# EAGLE design Button_Pad_Breakout-v05 (EAGLE 5.01)
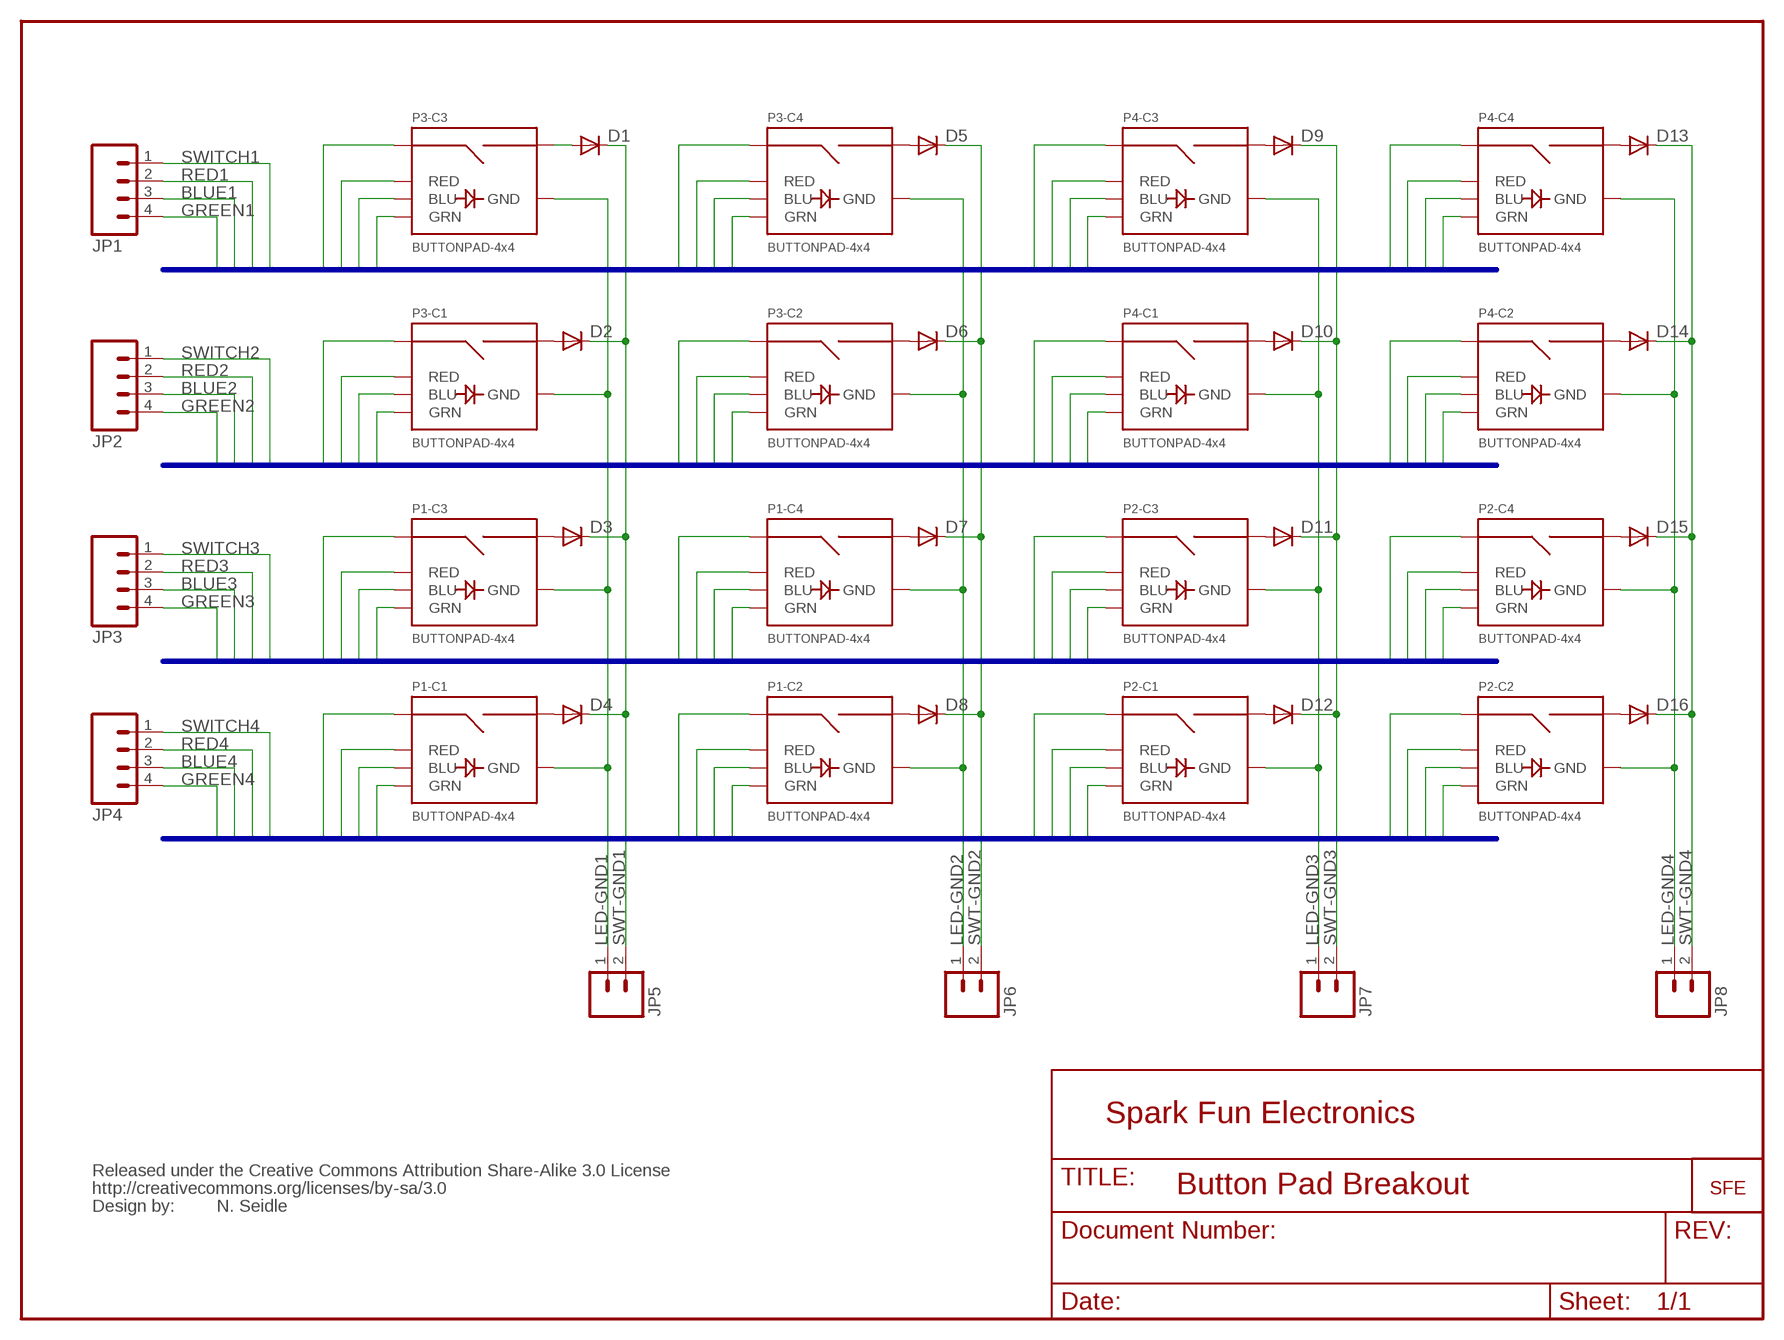
[diagram p0: schematic, sheet 1]

## Parts
D1  DIODE-1N4148  [DOIDE-1N4148]
D2  DIODE-1N4148  [DOIDE-1N4148]
D3  DIODE-1N4148  [DOIDE-1N4148]
D4  DIODE-1N4148  [DOIDE-1N4148]
D5  DIODE-1N4148  [DOIDE-1N4148]
D6  DIODE-1N4148  [DOIDE-1N4148]
D7  DIODE-1N4148  [DOIDE-1N4148]
D8  DIODE-1N4148  [DOIDE-1N4148]
D9  DIODE-1N4148  [DOIDE-1N4148]
D10  DIODE-1N4148  [DOIDE-1N4148]
D11  DIODE-1N4148  [DOIDE-1N4148]
D12  DIODE-1N4148  [DOIDE-1N4148]
D13  DIODE-1N4148  [DOIDE-1N4148]
D14  DIODE-1N4148  [DOIDE-1N4148]
D15  DIODE-1N4148  [DOIDE-1N4148]
D16  DIODE-1N4148  [DOIDE-1N4148]
JP1  M04POLAR  [MOLEX-1X4]
JP2  M04POLAR  [MOLEX-1X4]
JP3  M04POLAR  [MOLEX-1X4]
JP4  M04POLAR  [MOLEX-1X4]
JP5  M02POLAR  [MOLEX-1X2]
JP6  M02POLAR  [MOLEX-1X2]
JP7  M02POLAR  [MOLEX-1X2]
JP8  M02POLAR  [MOLEX-1X2]
P1  BUTTONPAD-4x4  BUTTONPAD-2X2  [BUTTONPAD-2X2]
P2  BUTTONPAD-4x4  BUTTONPAD-2X2  [BUTTONPAD-2X2]
P3  BUTTONPAD-4x4  BUTTONPAD-2X2  [BUTTONPAD-2X2]
P4  BUTTONPAD-4x4  BUTTONPAD-2X2  [BUTTONPAD-2X2]
U$1  LOGO-SFE  [SFE-NEW-WEBLOGO]
U$2  CREATIVE_COMMONS  [CREATIVE_COMMONS]

## Nets
BLUE1 [LEDPower]: JP1.3 P3.BLU3(-C3:BLU) P3.BLU4(-C4:BLU) P4.BLU3(-C3:BLU) P4.BLU4(-C4:BLU)
BLUE2 [LEDPower]: JP2.3 P3.BLU1(-C1:BLU) P3.BLU2(-C2:BLU) P4.BLU1(-C1:BLU) P4.BLU2(-C2:BLU)
BLUE3 [LEDPower]: JP3.3 P1.BLU3(-C3:BLU) P1.BLU4(-C4:BLU) P2.BLU3(-C3:BLU) P2.BLU4(-C4:BLU)
BLUE4 [LEDPower]: JP4.3 P1.BLU1(-C1:BLU) P1.BLU2(-C2:BLU) P2.BLU1(-C1:BLU) P2.BLU2(-C2:BLU)
GREEN1 [LEDPower]: JP1.4 P3.GRN3(-C3:GRN) P3.GRN4(-C4:GRN) P4.GRN3(-C3:GRN) P4.GRN4(-C4:GRN)
GREEN2 [LEDPower]: JP2.4 P3.GRN1(-C1:GRN) P3.GRN2(-C2:GRN) P4.GRN1(-C1:GRN) P4.GRN2(-C2:GRN)
GREEN3 [LEDPower]: JP3.4 P1.GRN3(-C3:GRN) P1.GRN4(-C4:GRN) P2.GRN3(-C3:GRN) P2.GRN4(-C4:GRN)
GREEN4 [LEDPower]: JP4.4 P1.GRN1(-C1:GRN) P1.GRN2(-C2:GRN) P2.GRN1(-C1:GRN) P2.GRN2(-C2:GRN)
LED-GND1 [LEDPower]: JP5.1 P1.GND1(-C1:GND) P1.GND3(-C3:GND) P3.GND1(-C1:GND) P3.GND3(-C3:GND)
LED-GND2 [LEDPower]: JP6.1 P1.GND2(-C2:GND) P1.GND4(-C4:GND) P3.GND2(-C2:GND) P3.GND4(-C4:GND)
LED-GND3 [LEDPower]: JP7.1 P2.GND1(-C1:GND) P2.GND3(-C3:GND) P4.GND1(-C1:GND) P4.GND3(-C3:GND)
LED-GND4 [LEDPower]: JP8.1 P2.GND2(-C2:GND) P2.GND4(-C4:GND) P4.GND2(-C2:GND) P4.GND4(-C4:GND)
N$1: D1.P$1(A) P3.SIG6(-C3:SIG2)
N$2: D2.P$1(A) P3.SIG2(-C1:SIG2)
N$3: D3.P$1(A) P1.SIG6(-C3:SIG2)
N$4: D4.P$1(A) P1.SIG2(-C1:SIG2)
N$5: D5.P$1(A) P3.SIG8(-C4:SIG2)
N$6: D6.P$1(A) P3.SIG4(-C2:SIG2)
N$7: D7.P$1(A) P1.SIG8(-C4:SIG2)
N$8: D8.P$1(A) P1.SIG4(-C2:SIG2)
N$9: D9.P$1(A) P4.SIG6(-C3:SIG2)
N$10: D10.P$1(A) P4.SIG2(-C1:SIG2)
N$11: D11.P$1(A) P2.SIG6(-C3:SIG2)
N$12: D12.P$1(A) P2.SIG2(-C1:SIG2)
N$13: D13.P$1(A) P4.SIG8(-C4:SIG2)
N$14: D14.P$1(A) P4.SIG4(-C2:SIG2)
N$15: D15.P$1(A) P2.SIG8(-C4:SIG2)
N$16: D16.P$1(A) P2.SIG4(-C2:SIG2)
RED1 [LEDPower]: JP1.2 P3.RED3(-C3:RED) P3.RED4(-C4:RED) P4.RED3(-C3:RED) P4.RED4(-C4:RED)
RED2 [LEDPower]: JP2.2 P3.RED1(-C1:RED) P3.RED2(-C2:RED) P4.RED1(-C1:RED) P4.RED2(-C2:RED)
RED3 [LEDPower]: JP3.2 P1.RED3(-C3:RED) P1.RED4(-C4:RED) P2.RED3(-C3:RED) P2.RED4(-C4:RED)
RED4 [LEDPower]: JP4.2 P1.RED1(-C1:RED) P1.RED2(-C2:RED) P2.RED1(-C1:RED) P2.RED2(-C2:RED)
SWITCH1 [ButtonSignal]: JP1.1 P3.SIG5(-C3:SIG1) P3.SIG7(-C4:SIG1) P4.SIG5(-C3:SIG1) P4.SIG7(-C4:SIG1)
SWITCH2 [ButtonSignal]: JP2.1 P3.SIG1(-C1:SIG1) P3.SIG3(-C2:SIG1) P4.SIG1(-C1:SIG1) P4.SIG3(-C2:SIG1)
SWITCH3 [ButtonSignal]: JP3.1 P1.SIG5(-C3:SIG1) P1.SIG7(-C4:SIG1) P2.SIG5(-C3:SIG1) P2.SIG7(-C4:SIG1)
SWITCH4 [ButtonSignal]: JP4.1 P1.SIG1(-C1:SIG1) P1.SIG3(-C2:SIG1) P2.SIG1(-C1:SIG1) P2.SIG3(-C2:SIG1)
SWT-GND1 [ButtonSignal]: D1.P$2(C) D2.P$2(C) D3.P$2(C) D4.P$2(C) JP5.2
SWT-GND2 [ButtonSignal]: D5.P$2(C) D6.P$2(C) D7.P$2(C) D8.P$2(C) JP6.2
SWT-GND3 [ButtonSignal]: D9.P$2(C) D10.P$2(C) D11.P$2(C) D12.P$2(C) JP7.2
SWT-GND4 [ButtonSignal]: D13.P$2(C) D14.P$2(C) D15.P$2(C) D16.P$2(C) JP8.2

## Buses
BUS3:RED3,BLUE3,GREEN3,SWITCH3
BUS2:RED2,BLUE2,GREEN2,SWITCH2
BUS1:RED1,BLUE1,GREEN1,SWITCH1
BUS4:RED4,BLUE4,GREEN4,SWITCH4

## Notes on the sheet
- Spark Fun Electronics
- Button Pad Breakout
- N. Seidle

## Library data of the parts
D1-D16 = SparkFun:DIODE-1N4148
JP1-JP4 = SparkFun:M04: Header 4 Standard 4-pin 0.1" header. Use with straight break away headers (SKU : PRT-00116), right angle break away headers (PRT-00553), swiss pins (PRT-00743), machine pins (PRT-00117), and female headers (PRT-00115). Molex polarized connector foot print use with SKU : PRT-08231 with associated crimp pins and housings.
JP5-JP8 = SparkFun:M02: Header 2 Standard 2-pin 0.1" header. Use with straight break away headers (SKU : PRT-00116), right angle break away headers (PRT-00553), swiss pins (PRT-00743), machine pins (PRT-00117), and female headers (PRT-00115). Molex polarized connector foot print use with SKU : PRT-08233 with associated crimp pins and housings.
P1-P4 = SparkFun:BUTTONPAD-2X2: 5mm Button Pad Proven layout and schematic for 2x2 button pad. Panelize this device/fp to a 4x4 pad if needed. Spark Fun Electronics SKU : COM-07835. Compatible common cathode tri-color LED SKU : COM-00105
U$1 = SparkFun:LOGO-SFE: Spark Fun Electronics PCB Logo This is the standard Spark Fun Electronics PCB logo.
U$2 = SparkFun:CREATIVE_COMMONS

## Net classes
0 Default: width 0.254 mm
1 Power: width 0.305 mm
2 LEDPower: width 0.305 mm
3 ButtonSignal: width 0.254 mm

## Board
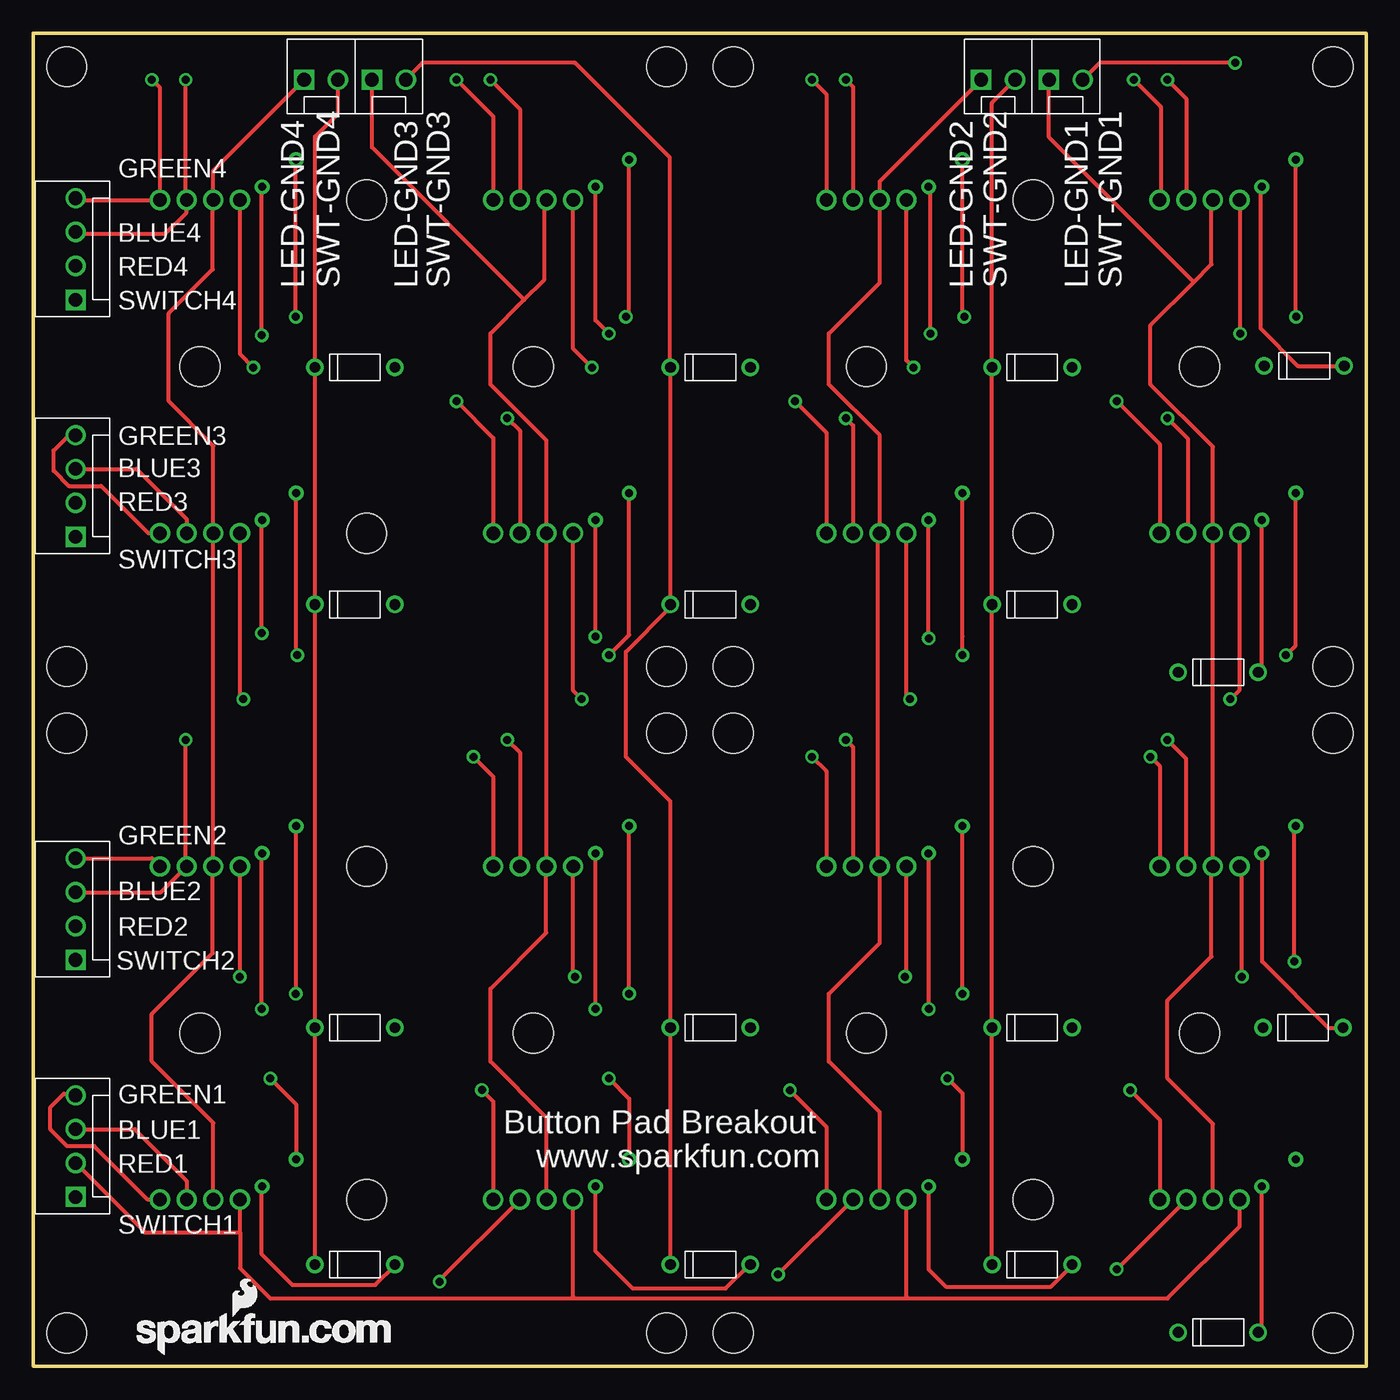
[diagram p1: board, top side]
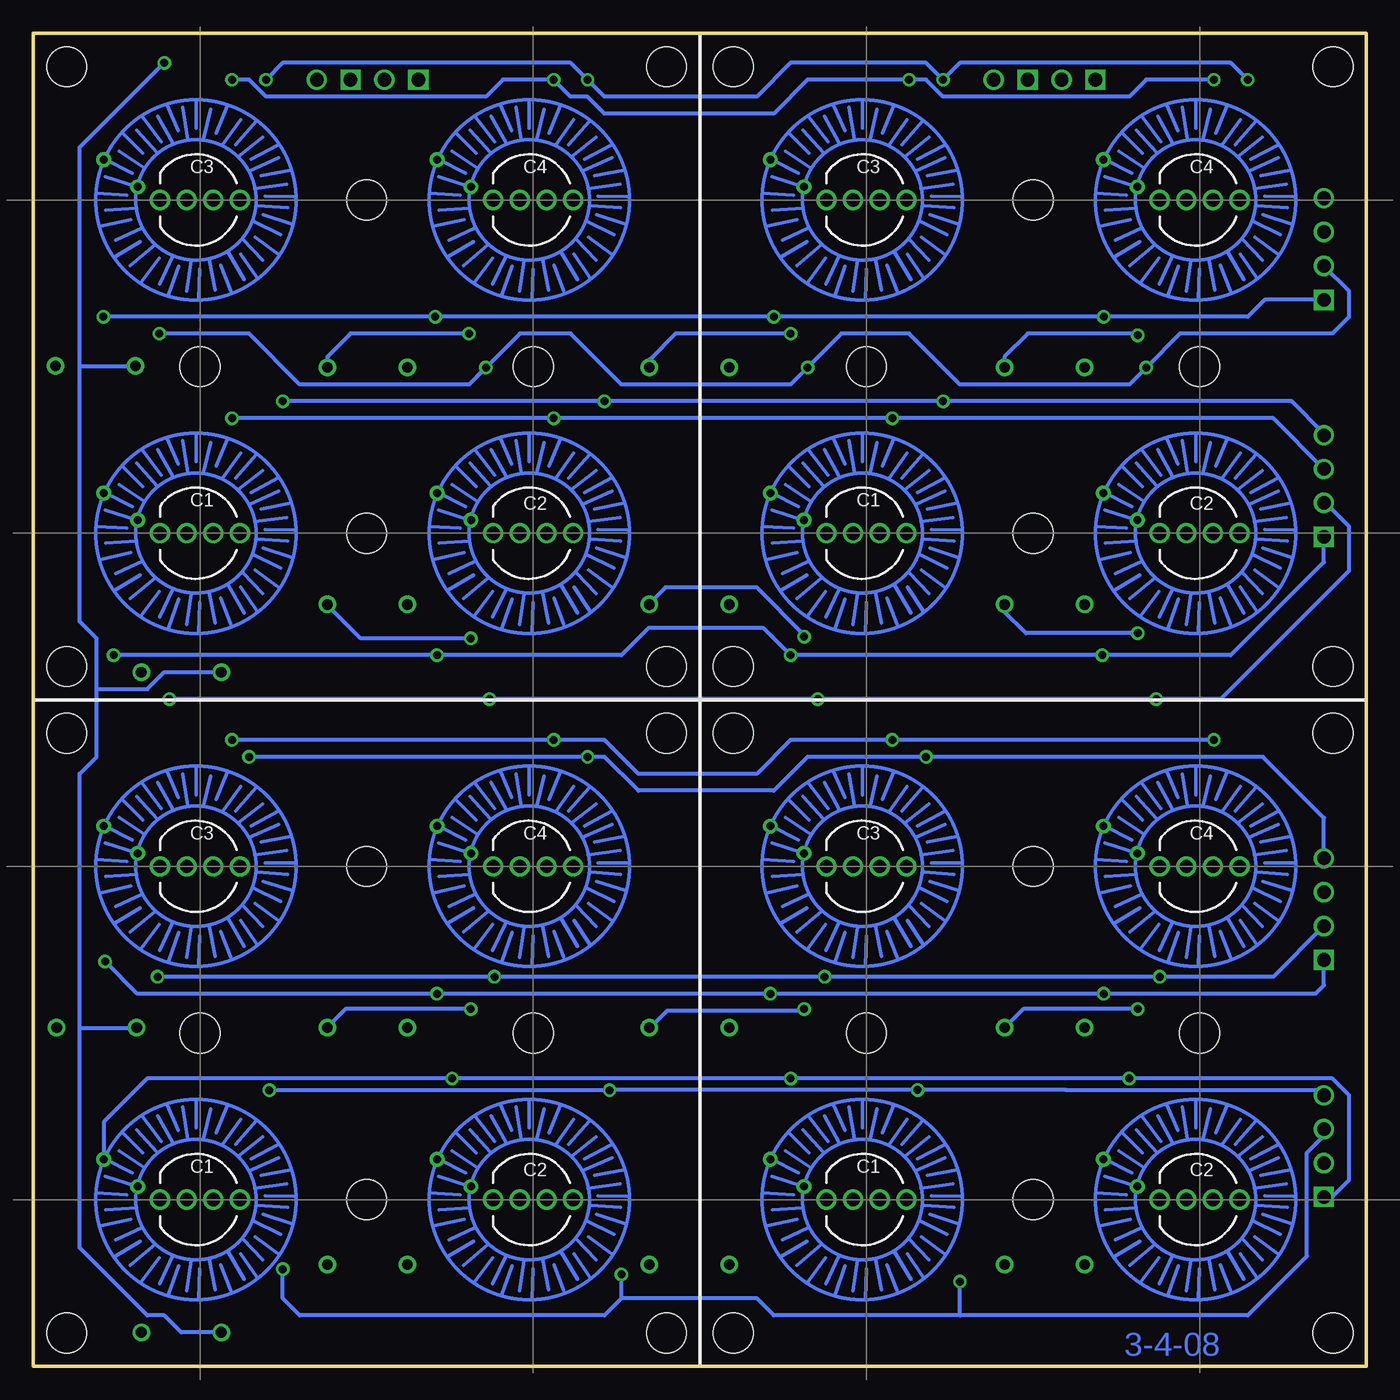
[diagram p2: board, bottom side, seen from below]

Size 100 x 100 mm. Coordinates in mm from the lower left corner, seen from the top.
Outline: 0,0 100,0 100,100 0,100 0,0
Copper layers (1*16): Top 0.035mm / dielectric 1.5mm / Bottom 0.035mm
Design rules "default": minimum track width 7mil, minimum drill 20mil, track to track 7mil, track to pad 7mil, pad to pad 7mil, via to via 7mil, smd to smd 7mil, copper to edge 20mil, drill to drill 7mil, minimum pad ring 10mil, minimum via ring 8mil, stop-mask expansion 4mil, vias tented up to drill 0mil, thermal gap 10mil

### Footprints (pad centres in the part's own frame; a part is rotated, then mirrored left to right if it is on the bottom)
DOIDE-1N4148 = drill 0.8 round: P$1 3,0; P$2 -3,0
MOLEX-1X4 = drill 1.016 square: 1 0,0 | drill 1.016 round: 2 2.54,0; 3 5.08,0; 4 7.62,0
MOLEX-1X2 = drill 1.016 square: 1 0,0 | drill 1.016 round: 2 2.54,0
BUTTONPAD-2X2 = drill 1 round: BLU1 13.5,12.5; BLU2 38.5,12.5; BLU3 13.5,37.5; BLU4 38.5,37.5; GND1 11.5,12.5; GND2 36.5,12.5; GND3 11.5,37.5; GND4 36.5,37.5; GRN1 15.5,12.5; GRN2 40.5,12.5; GRN3 15.5,37.5; GRN4 40.5,37.5; RED1 9.5,12.5; RED2 34.5,12.5; RED3 9.5,37.5; RED4 34.5,37.5 | drill 0.6 round: SIG1 5.288,15.513; SIG2 7.828,13.481; SIG3 30.288,15.513; SIG4 32.828,13.481; SIG5 5.288,40.513; SIG6 7.828,38.481; SIG7 30.288,40.513; SIG8 32.828,38.481 | hole 3: 12.5,25; 25,37.5; 37.5,25; 25,12.5; 2.5,2.5; 2.5,47.5; 47.5,47.5; 47.5,2.5

### Placement (x,y rotation side)
D1  50.8,74.93 0 top
D2  50.8,57.15 0 top
D3  50.8,25.4 0 top
D4  50.8,7.62 0 top
D5  24.13,74.93 0 top
D6  24.13,57.15 0 top
D7  24.13,25.4 0 top
D8  24.13,7.62 0 top
D9  95.35,75.05 0 top
D10  88.9,52.07 0 top
D11  95.25,25.4 0 top
D12  88.9,2.54 0 top
D13  74.93,74.93 0 top
D14  74.93,57.15 0 top
D15  74.93,25.4 0 top
D16  74.93,7.62 0 top
JP1  3.17,80.01 90 top
JP2  3.17,62.23 90 top
JP3  3.17,30.48 90 top
JP4  3.17,12.7 90 top
JP5  25.4,96.52 0 top
JP6  20.32,96.52 0 top
JP7  76.2,96.52 0 top
JP8  71.12,96.52 0 top
P1  50,0 0 bottom
P2  100,0 0 bottom
P3  50,50 0 bottom
P4  100,50 0 bottom
U$1  7.73,0.84 0 top
U$2  17.78,-10.16 0 top  (outside the outline)

### Tracks (layer width: path | path; a pad name or v marks a point on that pad's centre or on a via)
BLUE1  (via drill 0.6)
  Top 0.305: JP1.3 3.3,84.96 9.91,84.96 11.5,86.56 P3.BLU4 11.5,87.56 11.43,87.63 v11.43,96.52 | P3.BLU3 36.5,94.31 v34.29,96.52 | P4.BLU4 61.5,95.98 v60.96,96.52 | P4.BLU3 86.5,95.11 v85.09,96.52
  Bottom 0.305: v85.09,96.52 83.82,96.52 82.55,95.25 66.04,95.25 64.77,96.52 v60.96,96.52 59.69,95.25 58.42,95.25 57.15,93.98 44.45,93.98 41.91,96.52 v34.29,96.52 33.02,96.52 31.75,95.25 17.78,95.25 16.51,96.52 v11.43,96.52
BLUE2  (via drill 0.6)
  Top 0.305: P3.BLU2 11.5,63.56 7.75,67.31 JP2.3 | P3.BLU1 36.5,70.18 v35.56,71.12 | P4.BLU2 61.5,70.58 v60.96,71.12 | P4.BLU1 86.61,62.61 86.61,69.6 v85.09,71.12
  Bottom 0.305: v85.09,71.12 v60.96,71.12 v35.56,71.12 6.99,71.12 JP2.3
BLUE3  (via drill 0.6)
  Top 0.305: JP3.3 9.56,35.56 P1.BLU4 11.43,37.57 v11.43,46.99 | P1.BLU3 36.5,46.05 v35.56,46.99 | P2.BLU4 61.5,46.45 v60.96,46.99 | 86.49,37.49 86.49,37.47 | 86.49,37.49 P2.BLU3 | v85.09,46.99 86.49,45.59 86.49,37.49
  Bottom 0.305: v85.09,46.99 v60.96,46.99 57.15,46.99 54.61,44.45 45.72,44.45 43.18,46.99 v35.56,46.99 v11.43,46.99
BLUE4  (via drill 0.6)
  Top 0.305: P1.BLU2 11.5,13.9 7.62,17.78 JP4.3 | v81.28,7.28 P2.BLU1 | v55.88,6.88 P2.BLU2 | P1.BLU1 30.48,6.48 v30.48,6.35
  Bottom 0.305: 30.48,3.81 v30.48,6.35 | 30.48,3.81 8.89,3.81 4.45,8.26 4.45,16 3.17,17.27 JP4.3 | v81.28,7.28 81.28,5.08 80.01,3.81 57.15,3.81 55.88,5.08 | 30.48,3.81 44.45,3.81 45.72,5.08 55.88,5.08 | 55.88,5.08 v55.88,6.88
GREEN1  (via drill 0.6)
  Top 0.305: JP1.4 3.31,87.5 P3.GRN4 9.5,95.91 v8.89,96.52 | P3.GRN3 34.5,93.77 v31.75,96.52 | P4.GRN4 59.5,95.44 v58.42,96.52 | P4.GRN3 84.58,87.5 84.58,94.49 v82.55,96.52
  Bottom 0.305: v8.89,96.52 10.16,97.79 30.48,97.79 v31.75,96.52 33.02,97.79 43.18,97.79 45.72,95.25 57.15,95.25 v58.42,96.52 59.69,97.79 81.28,97.79 v82.55,96.52
GREEN2  (via drill 0.6)
  Top 0.305: P3.GRN2 8.62,62.5 5.08,66.04 2.67,66.04 1.52,67.18 1.52,68.71 2.79,69.98 2.92,69.85 JP2.4 | P4.GRN1 84.5,69.17 v81.28,72.39 | P4.GRN2 59.5,70.04 v57.15,72.39 | P3.GRN1 34.5,69.64 v31.75,72.39
  Bottom 0.305: v81.28,72.39 v57.15,72.39 v31.75,72.39 5.59,72.39 3.17,69.98 JP2.4
GREEN3  (via drill 0.6)
  Top 0.305: P1.GRN4 8.9,38.1 JP3.4 | P1.GRN3 34.5,44.24 v33.02,45.72 | P2.GRN4 59.5,44.64 v58.42,45.72 | P2.GRN3 84.5,45.04 v83.82,45.72
  Bottom 0.305: v83.82,45.72 v58.42,45.72 57.15,45.72 54.61,43.18 44.45,43.18 41.91,45.72 v33.02,45.72 7.75,45.72 3.17,41.15 JP3.4 3.3,38.1
GREEN4  (via drill 0.6)
  Top 0.305: P1.GRN2 8.58,12.5 4.57,16.51 2.54,16.51 1.27,17.78 1.27,19.43 2.29,20.45 3.05,20.45 JP4.4 | P2.GRN2 59.5,17.97 v56.77,20.7 | v33.66,20.73 33.66,20.7 34.5,19.86 P1.GRN1 | P2.GRN1 84.5,18.5 v82.3,20.7
  Bottom 0.305: JP4.4 3.56,20.7 22.48,20.7 22.5,20.73 v33.66,20.73 56.67,20.73 56.77,20.83 v56.77,20.7 v82.3,20.7
LED-GND1
  Top 0.305: P1.GND1 38.5,18.65 34.29,22.86 34.29,28.32 38.48,32.51 38.48,37.47 38.5,37.48 P1.GND3 38.5,62.59 | 38.5,62.59 P3.GND1 | 38.5,62.59 38.48,62.61 | 38.5,62.59 38.5,69.45 34.29,73.66 34.29,77.47 36.83,80.01 | 36.83,80.01 38.35,81.53 38.35,87.25 38.5,87.39 P3.GND3 | JP5.1 25.4,91.44 36.83,80.01
LED-GND2
  Top 0.305: JP6.1 13.5,89.7 P3.GND4 13.59,87.5 13.72,87.38 13.46,87.12 13.46,82.3 10.16,78.99 10.16,72.39 13.5,69.05 P3.GND2 13.48,62.5 13.46,62.48 13.5,62.45 P1.GND4 13.46,37.47 13.46,30.99 8.89,26.42 8.89,22.86 13.5,18.25 P1.GND2
LED-GND3
  Top 0.305: P2.GND1 88.5,18.18 85.09,21.59 85.09,27.43 88.39,30.73 88.39,37.47 88.43,37.5 P2.GND3 P4.GND1 | 87.06,81.34 83.82,78.11 83.82,73.66 88.5,68.98 P4.GND1 | 87.06,81.34 88.39,82.68 88.39,87.5 P4.GND3 | P4.GND1 88.39,62.61 | JP7.1 76.2,92.2 87.06,81.34
LED-GND4
  Top 0.305: P2.GND2 63.5,19.05 59.69,22.86 59.69,27.94 63.5,31.75 63.5,37.47 63.47,37.5 | 63.47,37.5 63.37,37.59 63.37,62.36 63.5,62.48 P4.GND2 63.5,69.85 59.69,73.66 59.69,77.47 63.5,81.28 P4.GND4 63.5,88.9 JP8.1 | 63.47,37.5 P2.GND4
N$1  (via drill 0.6)
  Top 0.305: P3.SIG6 42.17,78.48 v43.18,77.47
  Bottom 0.305: D1.P$1 53.75,75.54 51.82,77.47 v43.18,77.47
N$2  (via drill 0.6)
  Top 0.305: P3.SIG2 42.17,63.49 42.16,63.5 v42.16,54.74
  Bottom 0.305: v42.16,54.74 42.16,54.86 45.72,58.42 52.58,58.42 53.85,57.15 D2.P$1
N$3  (via drill 0.6)
  Top 0.305: P1.SIG6 42.17,38.36 42.16,38.35 v42.16,26.8
  Bottom 0.305: v42.16,26.8 42.29,26.67 52.45,26.67 53.72,25.4 D3.P$1
N$4
  Top 0.305: P1.SIG2 42.16,8.64 44.96,5.84 51.94,5.84 53.72,7.62 D4.P$1
N$5  (via drill 0.6)
  Top 0.305: P3.SIG8 17.17,88.42 17.14,88.39 v17.14,77.34
  Bottom 0.305: D5.P$1 27.13,75.74 25.4,77.47 17.53,77.47 17.27,77.22 v17.14,77.34
N$6  (via drill 0.6)
  Top 0.305: P3.SIG4 17.14,63.5 v17.14,54.99
  Bottom 0.305: D6.P$1 27.13,56.59 25.53,54.99 v17.14,54.99
N$7  (via drill 0.6)
  Top 0.305: P1.SIG8 17.14,38.48 v17.14,26.8
  Bottom 0.305: D7.P$1 25.73,26.8 v17.14,26.8
N$8
  Top 0.305: P1.SIG4 17.14,13.45 17.14,8.38 19.43,6.1 25.65,6.1 27.18,7.62 D8.P$1
N$9
  Top 0.305: P4.SIG6 92.17,88.36 92.08,88.27 92.08,77.85 94.88,75.05 D9.P$1
N$10
  Top 0.305: D10.P$1 91.82,52.07 92.17,52.42 P4.SIG2
N$11
  Top 0.305: D11.P$1 97.16,25.4 92.2,30.35 92.2,38.35 92.17,38.38 P2.SIG6
N$12
  Top 0.305: D12.P$1 91.9,2.46 91.95,2.41 92.17,2.64 P2.SIG2
N$13  (via drill 0.6)
  Top 0.305: P4.SIG8 67.17,88.4 67.31,88.27 v67.31,77.47
  Bottom 0.305: D13.P$1 77.93,75.74 76.2,77.47 67.56,77.47 67.44,77.6 v67.31,77.47
N$14  (via drill 0.6)
  Top 0.305: P4.SIG4 67.17,54.62 v67.18,54.61
  Bottom 0.305: D14.P$1 77.98,57.15 75.44,54.61 v67.18,54.61
N$15  (via drill 0.6)
  Top 0.305: P2.SIG8 67.06,38.48 67.18,38.35 v67.18,26.8
  Bottom 0.305: D15.P$1 77.98,25.4 76.58,26.8 v67.18,26.8
N$16
  Top 0.305: P2.SIG4 67.18,13.46 67.18,7.24 68.45,5.97 76.33,5.97 77.98,7.62 D16.P$1
RED1  (via drill 0.6)
  Top 0.305: P3.RED4 15.5,75.94 v16.51,74.93 | P3.RED3 40.5,76.34 v41.91,74.93 | P4.RED4 65.5,75.47 v66.04,74.93 | P4.RED3 90.55,87.5 v90.55,77.47
  Bottom 0.305: JP1.2 1.27,80.64 1.27,78.74 2.54,77.47 13.97,77.47 v16.51,74.93 17.78,73.66 30.48,73.66 34.29,77.47 39.37,77.47 v41.91,74.93 43.18,73.66 55.88,73.66 59.69,77.47 63.5,77.47 v66.04,74.93 | v66.04,74.93 67.31,73.66 | 67.31,73.66 80.01,73.66 83.82,77.47 v90.55,77.47 | v66.04,74.93 66.04,74.8 66.17,74.8 67.31,73.66
RED2  (via drill 0.6)
  Top 0.305: v15.75,50.04 15.75,50.16 15.5,50.41 P3.RED2 | P3.RED1 40.5,50.69 v41.15,50.04 | P4.RED2 65.5,50.32 v65.79,50.04 | P4.RED1 90.5,50.75 v89.79,50.04
  Bottom 0.305: JP2.2 3.05,64.77 1.27,62.99 1.27,59.69 10.92,50.04 v15.75,50.04 v41.15,50.04 v65.79,50.04 v89.79,50.04
RED3  (via drill 0.6)
  Top 0.305: P2.RED3 90.52,37.5 90.68,37.34 v90.68,29.21 | v65.41,29.21 65.41,29.34 65.5,29.43 P2.RED4 | v40.64,29.21 40.64,29.34 40.5,29.48 P1.RED3 | P1.RED4 v15.5,29.22 v15.49,29.21
  Bottom 0.305: v90.68,29.21 v65.41,29.21 v40.64,29.21 16.38,29.21 v15.49,29.21 6.99,29.21 JP3.2
RED4
  Top 0.305: 15.5,11.82 P1.RED2 15.5,10.03 | JP4.2 8.38,10.03 15.5,10.03 | 15.5,10.03 15.5,7.36 17.78,5.08 40.51,5.08 | 40.51,5.08 65.41,5.08 | 65.41,5.08 65.53,5.08 65.53,5.21 65.5,5.24 P2.RED2 | 40.51,5.08 40.51,5.21 40.5,5.22 P1.RED1 | P2.RED1 90.5,10.49 85.09,5.08 65.41,5.08
SWITCH1  (via drill 0.6)
  Top 0.305: P3.SIG7 19.71,90.45 19.68,90.42 v19.68,78.74 | P3.SIG5 44.71,79 v44.45,78.74 | P4.SIG7 69.71,78.88 v69.85,78.74 | P4.SIG5 94.71,78.77 v94.74,78.74
  Bottom 0.305: JP1.1 7.62,80.01 8.89,78.74 v19.68,78.74 v44.45,78.74 v69.85,78.74 v94.74,78.74
SWITCH2  (via drill 0.6)
  Top 0.305: P3.SIG3 19.71,53.95 v19.81,53.34 | P3.SIG1 44.71,54.87 v43.18,53.34 | P4.SIG3 69.71,54.75 v69.72,53.34 | P4.SIG1 94.71,54.07 v93.98,53.34
  Bottom 0.305: JP2.1 3.17,60.33 10.16,53.34 v19.81,53.34 v43.18,53.34 45.21,55.37 53.85,55.37 55.88,53.34 v69.72,53.34 v93.98,53.34
SWITCH3  (via drill 0.6)
  Top 0.305: P2.SIG5 94.71,40.48 94.61,40.39 v94.61,30.35 | P2.SIG7 69.71,28.08 69.72,28.07 v69.72,27.94 | P1.SIG5 44.71,27.95 v44.7,27.94 | P1.SIG7 19.71,27.97 v19.68,27.94
  Bottom 0.305: JP3.1 3.17,28.57 3.81,27.94 v19.68,27.94 v44.7,27.94 v69.72,27.94 92.2,27.94 v94.61,30.35
SWITCH4  (via drill 0.6)
  Top 0.305: P2.SIG3 69.71,20.46 v68.58,21.59 | P1.SIG1 44.71,20.06 v43.18,21.59 | P1.SIG3 19.71,19.66 v17.78,21.59
  Bottom 0.305: P2.SIG1 94.71,18.32 91.44,21.59 v68.58,21.59 v43.18,21.59 v17.78,21.59 2.54,21.59 1.27,20.32 1.27,13.97 2.54,12.7 JP4.1
SWT-GND1
  Top 0.305: 47.75,74.93 D1.P$2 | 47.75,74.93 47.8,74.88 D2.P$2 47.8,56.94 44.45,53.59 44.45,45.72 47.8,42.37 D3.P$2 47.75,25.4 47.8,25.35 D4.P$2 | 47.75,74.93 47.75,90.68 40.64,97.79 29.21,97.79 JP5.2
SWT-GND2
  Top 0.305: JP6.2 22.86,93.98 21.13,92.25 D5.P$2 21.13,57.2 21.08,57.15 | D8.P$2 21.13,25.35 21.08,25.4 D7.P$2 21.13,57.1 21.08,57.15 | 21.08,57.15 D6.P$2
SWT-GND3  (via drill 0.6)
  Top 0.305: v90.17,97.79 80.01,97.79 JP7.2
  Bottom 0.305: D12.P$2 88.9,2.54 90.17,3.81 91.44,3.81 96.52,8.89 96.52,25.4 | 96.52,25.4 96.52,44.45 95.25,45.72 95.25,50.8 | 95.25,50.8 95.25,54.61 96.52,55.88 96.52,75.06 | 96.52,25.4 D11.P$2 | D10.P$2 90.17,52.07 91.44,50.8 95.25,50.8 | 96.52,75.06 96.52,91.44 v90.17,97.79 | D9.P$2 96.51,75.05 96.52,75.06
SWT-GND4
  Top 0.305: JP8.2 71.93,94.79 D13.P$2 71.93,57.2 71.88,57.15 D14.P$2 D15.P$2 | D15.P$2 71.93,25.32 71.88,25.27 | D16.P$2 71.88,7.62 71.93,7.67 D15.P$2

### Text on the board
Bottom: 3-4-08
tPlace: GREEN4 | BLUE4 | RED4 | LED-GND4 | SWT-GND4 | LED-GND3 | SWT-GND3 | LED-GND2 | SWT-GND2 | LED-GND1 | SWT-GND1 | SWITCH4 | GREEN3 | BLUE3 | RED3 | SWITCH3 | GREEN2 | BLUE2 | RED2 | SWITCH2 | GREEN1 | BLUE1 | Button Pad Breakout | www.sparkfun.com | RED1 | SWITCH1 | N. Seidle